# Altium project Relay_board.PrjPcb
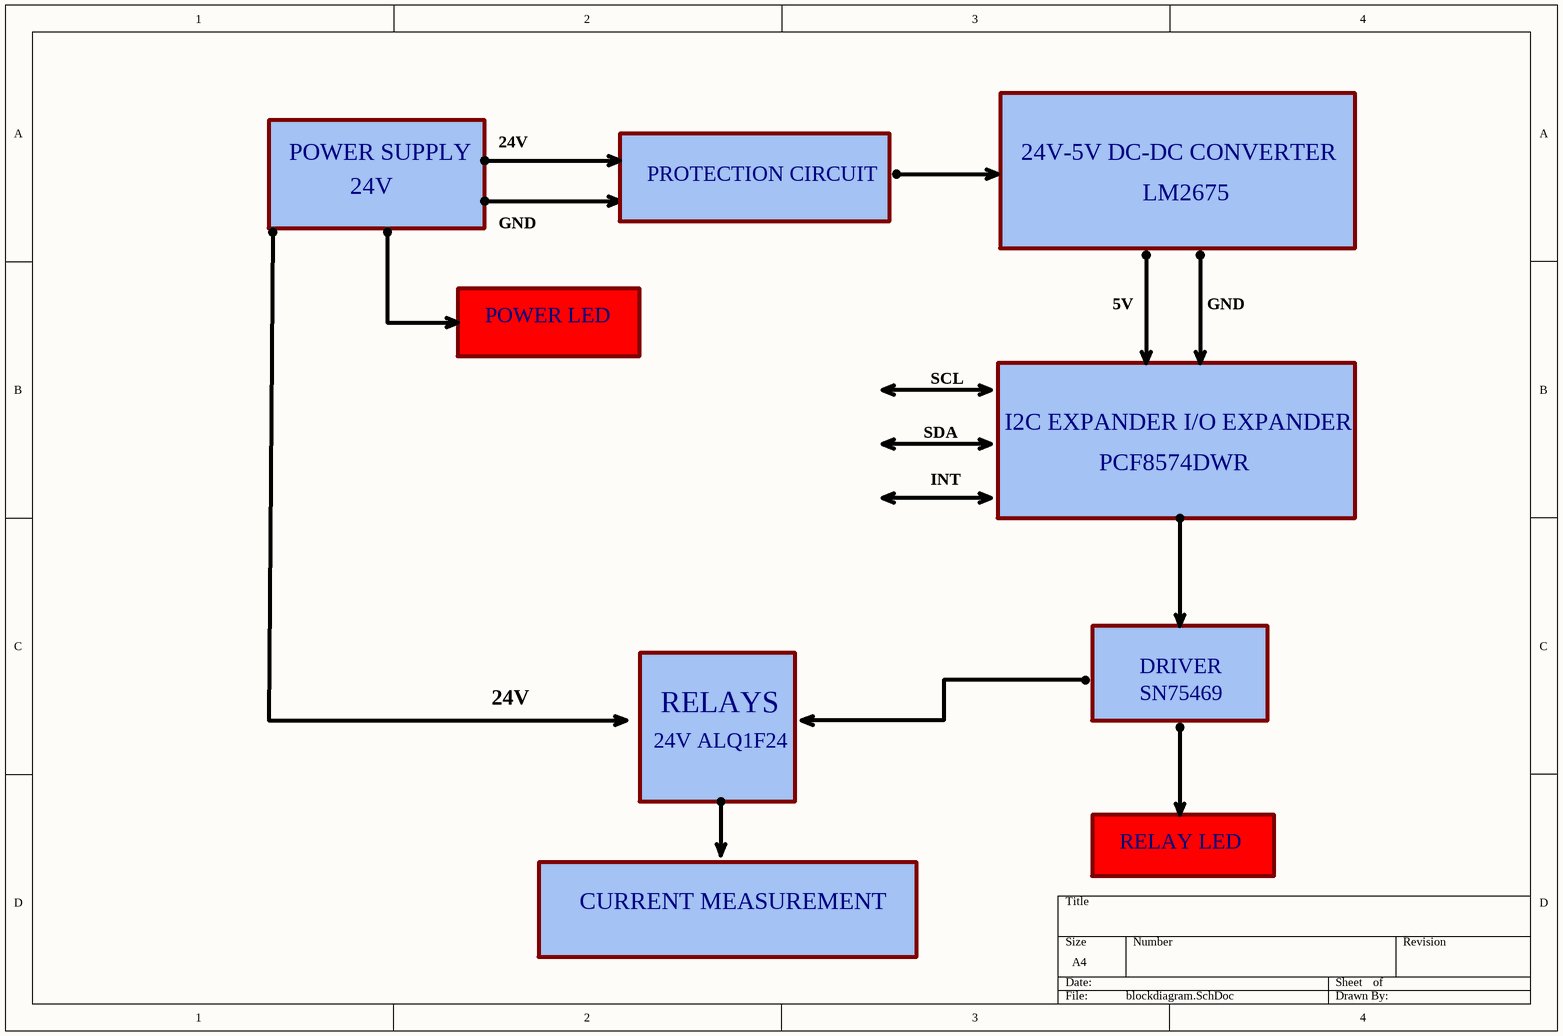
[diagram p0: blockdiagram.SchDoc]
3 sheets, 43 parts. Net scope: flat (ports and power ports of the same name join across sheets).
Board file: Relayboard.PcbDoc
Sheets:
  blockdiagram.SchDoc
  RELAYBOARD.SchDoc
  connectors.SchDoc

## Sheet blockdiagram.SchDoc
size A4

### Notes on the sheet
- POWER SUPPLY
- 24V
- 24V-5V DC-DC CONVERTER
- GND
- PROTECTION CIRCUIT
- LM2675
- 5V
- POWER LED
- SCL
- SDA
- I2C EXPANDER I/O EXPANDER
- INT
- PCF8574DWR
- RELAYS
- DRIVER
- SN75469
- 24V ALQ1F24
- RELAY LED
- CURRENT MEASUREMENT

## Sheet RELAYBOARD.SchDoc
size A4
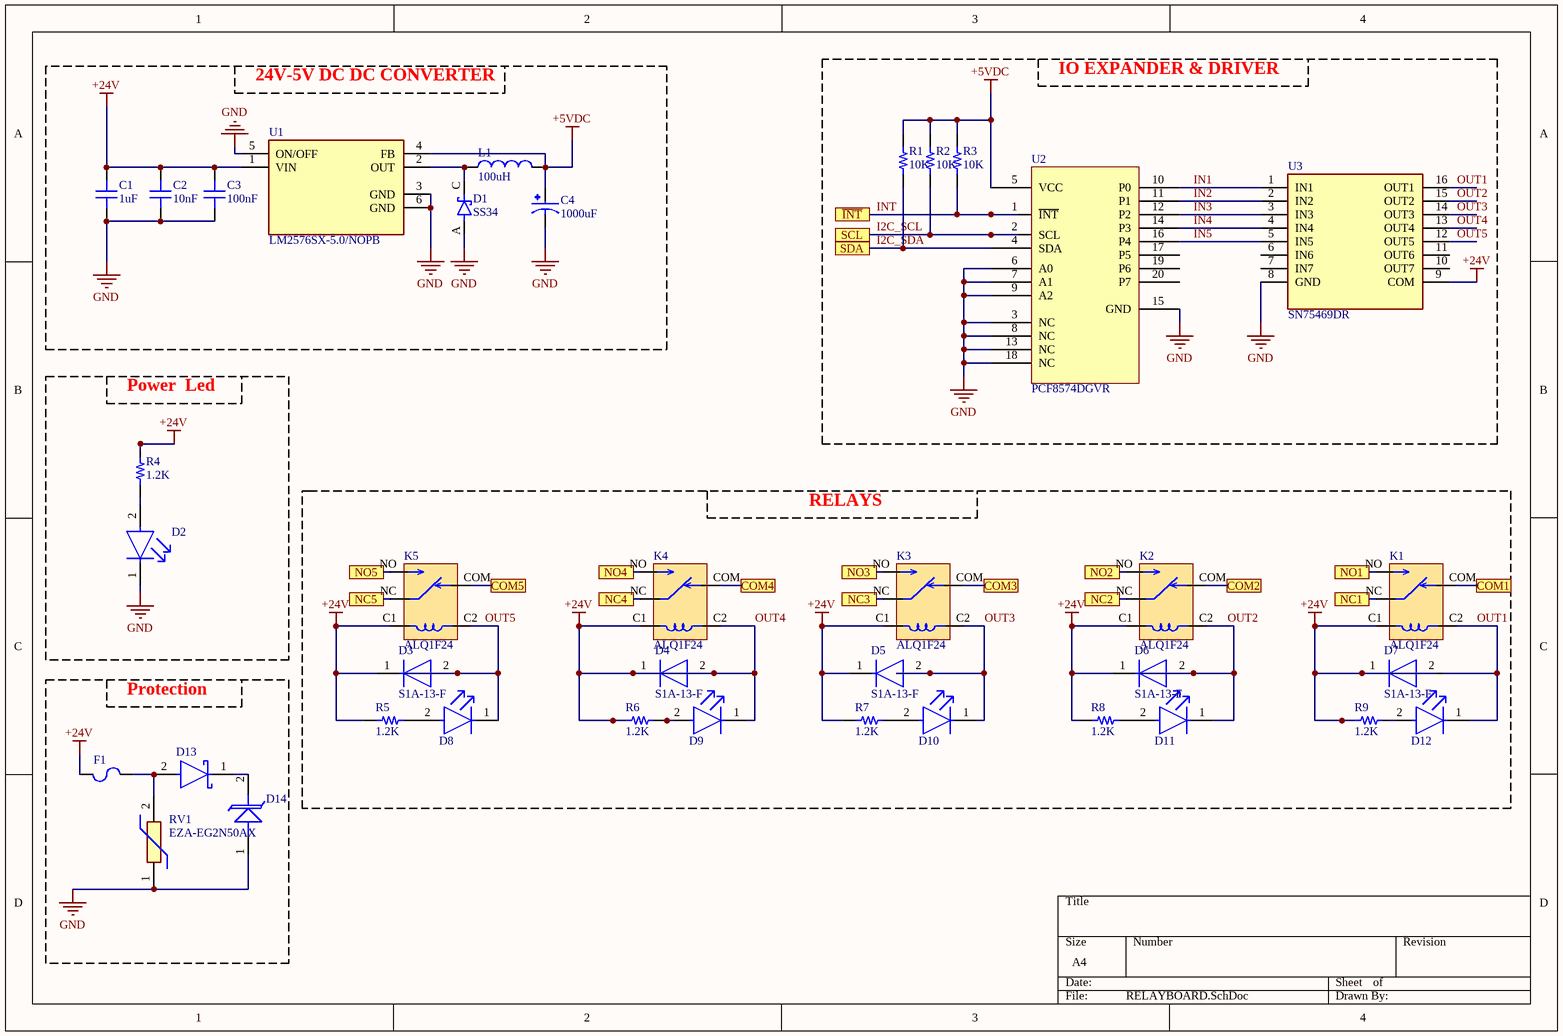
[diagram p1: RELAYBOARD.SchDoc]

### Parts
C1  1uF  [CAP-0603]
C2  10nF  [CAP-0603]
C3  100nF  [CAP-0603]
C4  1000uF  [CAP RADIAL 1000UF]
D1  SS34  [SS34]
D2  LS R976-NR-1  [LS R976-NR-1]  (value not drawn)
D3  S1A-13-F  [S1A-13-F]
D4  S1A-13-F  [S1A-13-F]
D5  S1A-13-F  [S1A-13-F]
D6  S1A-13-F  [S1A-13-F]
D7  S1A-13-F  [S1A-13-F]
D8  LS R976-NR-1  [LS R976-NR-1]  (value not drawn)
D9  LS R976-NR-1  [LS R976-NR-1]  (value not drawn)
D10  LS R976-NR-1  [LS R976-NR-1]  (value not drawn)
D11  LS R976-NR-1  [LS R976-NR-1]  (value not drawn)
D12  LS R976-NR-1  [LS R976-NR-1]  (value not drawn)
D13  SS3P5-M3/84A  [SS3P5-M3/84A]  (value not drawn)
D14  PESD1IVN27-AX  [PESD1IVN27-AX]  (value not drawn)
F1  SF-1206S150-2  [FUSE 1206_3216 0.6MM]  (value not drawn)
K1  ALQ1F24  [ALQ1F24-5]
K2  ALQ1F24  [ALQ1F24-5]
K3  ALQ1F24  [ALQ1F24-5]
K4  ALQ1F24  [ALQ1F24-5]
K5  ALQ1F24  [ALQ1F24-5]
L1  100uH  [CBC3225T101MR]
R1  10K  [0603]
R2  10K  [0603]
R3  10K  [0603]
R4  1.2K  [0603]
R5  1.2K  [0603]
R6  1.2K  [0603]
R7  1.2K  [0603]
R8  1.2K  [0603]
R9  1.2K  [0603]
RV1  EZA-EG2N50AX  [EZA-EG2N50AX]
U1  LM2576SX-5.0/NOPB  [LM2576SX-5.0/NOPB]
U2  PCF8574DGVR  [TVSOP-20]
U3  SN75469DR  [SN75469DR-SOIC16]

### Blocks framed on the sheet
24V-5V DC DC CONVERTER: C1-C4 D1 L1 U1
IO EXPANDER & DRIVER: R1-R3 U2 U3
Power  Led: D2 R4
RELAYS: D3-D12 K1-K5 R5-R9
Protection: D13 D14 F1 RV1

### Ports
COM1, COM2, COM3, COM4, COM5, NC1, NC2, NC3, NC4, NC5, NO1, NO2, NO3, NO4, NO5, SCL, SDA, ~{INT}

### Nets
+5VDC: C4.1 L1.2 R1.2 R2.2 R3.2 U1.4(FB) U2.5(VCC)
GND: C1.1 C2.1 C3.1 C4.2 D1.A D2.1(C) D14.1 RV1.1 U1.3(GND) U1.5(ON/OFF) U1.6(GND) U2.3(NC) U2.6(A0) U2.7(A1) U2.8(NC) U2.9(A2) U2.13(NC) U2.15(GND) U2.18(NC) U3.8(GND)
OUT4: C1.2 C2.2 C3.2 D3.1(C) D4.1(C) D4.2(A) D5.1(C) D6.1(C) D7.1(C) D9.1(C) F1.1 K1.C1(COIL_1) K2.C1(COIL_1) K3.C1(COIL_1) K4.C1(COIL_1) K4.C2(COIL_2) K5.C1(COIL_1) R4.2 R5.1 R6.1 R7.1 R8.1 R9.1 U1.1(VIN) U3.9(COM) U3.13(OUT4)  [also labelled +24V]
I2C_SCL: R2.1 U2.2(SCL) ; port SCL
I2C_SDA: R1.1 U2.4(SDA) ; port SDA
IN1: U2.10(P0) U3.1(IN1)
IN2: U2.11(P1) U3.2(IN2)
IN3: U2.12(P2) U3.3(IN3)
IN4: U2.14(P3) U3.4(IN4)
IN5: U2.16(P4) U3.5(IN5)
INT: R3.1 U2.1(~{INT}) ; port ~{INT}
OUT1: D7.2(A) D12.1(C) K1.C2(COIL_2) U3.16(OUT1)
OUT2: D6.2(A) D11.1(C) K2.C2(COIL_2) U3.15(OUT2)
OUT3: D5.2(A) D10.1(C) K3.C2(COIL_2) U3.14(OUT3)
OUT5: D3.2(A) D8.1(C) K5.C2(COIL_2) U3.12(OUT5)
NetCN3_1: K1.NO ; port NO1
NetCN3_2: K1.COM ; port COM1
NetCN3_3: K1.NC ; port NC1
NetCN3_4: K2.NO ; port NO2
NetCN3_5: K2.COM ; port COM2
NetCN4_1: K2.NC ; port NC2
NetCN4_2: K3.NO ; port NO3
NetCN4_3: K3.COM ; port COM3
NetCN4_4: K3.NC ; port NC3
NetCN4_5: K4.NO ; port NO4
NetCN5_1: K4.COM ; port COM4
NetCN5_2: K4.NC ; port NC4
NetCN5_3: K5.NO ; port NO5
NetCN5_4: K5.COM ; port COM5
NetCN5_5: K5.NC ; port NC5
NetD1_C: D1.C(K) L1.1 U1.2(OUT)
NetD2_2: D2.2(A) R4.1
NetD8_2: D8.2(A) R5.2
NetD9_2: D9.2(A) R6.2
NetD10_2: D10.2(A) R7.2
NetD11_2: D11.2(A) R8.2
NetD12_2: D12.2(A) R9.2
NetD13_1: D13.1(C) D14.2
NetD13_2: D13.2(A) F1.2 RV1.2

Not connected (* = marked no-connect by the designer): U2 17(P5) 19(P6) 20(P7); U3 6(IN6) 7(IN7) 10(OUT7) 11(OUT6)

### Library data of the parts
C1 = UMK107ABJ105MAHT: Cap Ceramic 1uF 50V X5R 20% Pad SMD 0603 85C Low ESR Automotive T/R; Manufacturer: Taiyo Yuden; Supplier 1: Digi-Key; Manufacturer Part Number: UMK107ABJ105MAHT; RoHS: Yes; Category: Ceramic Capacitors; Stock 1: 1950; Pricing 1: 1=0,27000, 10=0,18400, 50=0,11020, 100=0,09310, 500=0,06368, 1000=0,05634 (USD); Mount: Surface Mount; Case/Package: 0603; Case Code (Imperial): 0603; Case Code (Metric): 1608; Min Operating Temperature: -55°C; Max Operating Temperature: 85°C; Packaging: Tape and Reel; Capacitance: 1uF; Tolerance: 20%; Voltage Rating: 50V; Ratings: AEC-Q200; RoHS Compliant: Yes; ComponentLink1URL: https://www.yuden.co.jp/productdata/catalog/mlcc_all_hq_e.pdf?src-supplier=Digi-Key; ComponentLink1Description: https://www.yuden.co.jp/productdata/catalog/mlcc_all_hq_e.pdf?src-supplier=Digi-Key; Supplier Part Number 1: 587-4958-1-ND
C2 = C0603C103M5RAC7411: Cap Ceramic 0.01uF 50V X7R 20% SMD 0603 125°C Paper T/R; Manufacturer: KEMET; Supplier 1: Digi-Key; Manufacturer Part Number: C0603C103M5RAC7411; RoHS: Yes; Category: Ceramic Capacitors; Stock 1: 336197; Pricing 1: 1=0,10000, 10=0,03000, 50=0,01640, 100=0,01350, 500=0,00962, 1000=0,00756, 2500=0,00688, 5000=0,00632 (USD); Mount: Surface Mount; Case/Package: 0603; Case Code (Imperial): 0603; Case Code (Metric): 1608; Contact Plating: Tin,Matte; Dielectric Material: Ceramic; Min Operating Temperature: -55°C; Max Operating Temperature: 125°C; Packaging: Tape and Reel; Package Quantity: 50000; Tolerance: 20%; Voltage Rating: 50V; Voltage Rating (DC): 50V; Capacitance: 10nF; Dielectric: X7R; Termination: SMD/SMT; Series: C0603C; Construction: Flat; Length: 1.6mm; Height: 0.8mm; Lead Pitch: 0.7mm; Depth: 0.8mm; Radiation Hardening: No; RoHS Compliant: Yes; ComponentLink1URL: http://www.mouser.com/ds/2/212/KEM_C1002_X7R_SMD-1102033.pdf?src-supplier=Mouser; ComponentLink1Description: http://www.mouser.com/ds/2/212/KEM_C1002_X7R_SMD-1102033.pdf?src-supplier=Mouser; ComponentLink2URL: http://capacitoredge.kemet.com/capedge2/DataSheet?pn=C0603C103M5RAC7411&src-supplier=Avnet; ComponentLink2Description: http://capacitoredge.kemet.com/capedge2/DataSheet?pn=C0603C103M5RAC7411&src-supplier=Avnet; Supplier Part Number 1: 399-C0603C103M5RAC7411CT-ND
C3 = C0603C104K5RAC7411: Cap Ceramic 0.1uF 50V X7R 10% SMD 0603 125°C Paper T/R 100nF; Manufacturer: KEMET; Dissipation Factor: 2.5%; Supplier 1: Digi-Key; Manufacturer Part Number: C0603C104K5RAC7411; RoHS: Yes; Category: Ceramic Capacitors; Stock 1: 3300000; Pricing 1: 15000=0,01540, 30000=0,01463, 75000=0,01309, 105000=0,01059, 150000=0,01024, 375000=0,00963 (USD); Mount: Surface Mount; Case/Package: 0603; Case Code (Metric): 1608; Case Code (Imperial): 0603; Dielectric Material: Ceramic; Min Operating Temperature: -55°C; Max Operating Temperature: 125°C; Tolerance: 10%; Capacitance: 100nF; Dielectric: X7R; Voltage Rating (DC): 50V; Packaging: Tape and Reel; Package Quantity: 15000; Voltage Rating: 50V; Termination: SMD/SMT; Length: 1.6mm; Width: 0.031inch; Height: 0.8mm; Thickness: 0.035inch; Lead Pitch: 0.7mm; Depth: 0.8mm; Radiation Hardening: No; ComponentLink1URL: https://datasheet.ciiva.com/5424/kem-c1002-x7r-smd-5424426.pdf?src-supplier=Mouser; ComponentLink1Description: https://datasheet.ciiva.com/5424/kem-c1002-x7r-smd-5424426.pdf?src-supplier=Mouser; Supplier Part Number 1: 399-7374-2-ND
C4 = EEETK1E102AM: Cap Aluminum Lytic 1000uF 25V 20% (18 X 16.5mm) SMD 0.075 Ohm 1300mA 2000h 125C Automotive T/R; Manufacturer: Panasonic; Manufacturer Part Number: EEE-TK1E102AM; Ripple Current: 1.3A; Capacitance: 1mF; ESR (Equivalent Series Resistance): 75mR; Life (Hours): 2000Hour; Leakage Current: 300uA; Dissipation Factor: 0.18%; Polarity: Polar; Lead Diameter: 1.2mm; Supplier 1: Digi-Key; RoHS: Yes; Category: Aluminum Electrolytic Capacitors; Stock 1: 337; Pricing 1: 1=3,55000, 10=2,86900, 50=2,50360 (USD); Mount: Surface Mount; Case/Package: Radial; Number of Pins: 16; Min Operating Temperature: -40°C; Max Operating Temperature: 125°C; Tolerance: 20%; Voltage Rating: 25V; Ripple Current (AC): 1.3A; Packaging: Tape and Reel; Package Quantity: 125; Voltage Rating (DC): 25V; Termination: SMD/SMT; Voltage: 25V; Series: TK; Construction: Cylindrical; Diameter: 18mm; Length: 16.5mm; Height: 16.5mm; Lead Pitch: 6.7mm; Height - Seated (Max): 0.65inch; REACH SVHC: No SVHC; Lead Free: Lead Free; RoHS Compliant: Yes; ComponentLink1URL: https://datasheet.ciiva.com/11777/0900766b8102e63d-11777138.pdf?src-supplier=RSComponents; ComponentLink1Description: https://datasheet.ciiva.com/11777/0900766b8102e63d-11777138.pdf?src-supplier=RSComponents; ComponentLink2URL: https://datasheet.ciiva.com/24071/aba0000ce121-470559-24071175.pdf?src-supplier=Mouser; ComponentLink2Description: https://datasheet.ciiva.com/24071/aba0000ce121-470559-24071175.pdf?src-supplier=Mouser; Supplier Part Number 1: PCE4890CT-ND
D1 = SS34: SS Series 500 mV 3 A 40 V Max Reverse Voltage Schottky Rectifier - DO-214AB; Manufacturer: ON Semiconductor / Fairchild; Number of Terminals/Pins: 2; Current Rating: 3A; Voltage Rating (DC): 40V; Element Configuration: Single; Max Forward Surge Current (Ifsm): 100A; Max Reverse Current: 500uA; Forward Voltage: 500mV; Polarity: Standard; Max Power Dissipation: 2.27W; Number of Elements: 1; Supplier 1: Digi-Key; Manufacturer Part Number: SS34; RoHS: Yes; Category: Schottky Diodes; Stock 1: 48500; Pricing 1: 3000=0,28805 (USD); Mount: Surface Mount; Case/Package: SMC; Number of Pins: 2; Contact Plating: Tin,Matte; Min Operating Temperature: -55°C; Max Operating Temperature: 150°C; Packaging: Tape and Reel; Package Quantity: 1; Forward Current: 3A; Max Repetitive Reverse Voltage (Vrrm): 40V; Output Current: 3A; Peak Non-Repetitive Surge Current: 100A; Average Rectified Current: 3A; Max Reverse Voltage (DC): 40V; Max Surge Current: 100A; Max Reverse Leakage Current: 500uA; Current: 3A; Voltage: 40V; Length: 7.15mm; Width: 6.25mm; Height: 2.75mm; Radiation Hardening: No; RoHS Compliant: Yes; REACH SVHC: No SVHC; Lead Free: Lead Free; Supplier Part Number 1: SS34FSTR-ND
D2 D8-D12 = LS R976-NR-1: Led SMT Red 0805 Tape; Manufacturer: Osram Opto; Lens Color: White; Forward Current: 25mA; Forward Voltage: 2.5V; Luminous Intensity: 180mcd; Viewing Angle: 160°; Lens Style: Flat,Diffused,Colorless,Rectangular; Test Current: 20mA; Dominant Wavelength: 633nm; Luminous Flux: 0.47lm; Number of Elements: 1; Reverse Voltage: 12V; Power Dissipation: 65mW; Lens Transparency: Diffused; Lens Size: 1.25mm; Supplier 1: Digi-Key; Manufacturer Part Number: LSR976-NR-1; RoHS: Yes; Category: LEDs; Stock 1: 165904; Pricing 1: 1=0,31000, 10=0,16700, 100=0,07750, 500=0,07152, 1000=0,05602, 2000=0,05483 (USD); Mount: Surface Mount; Case/Package: 0805; Number of Pins: 2; Color: Red; Case Code (Metric): 2012; Case Code (Imperial): 0805; Min Operating Temperature: -30°C; Max Operating Temperature: 85°C; Packaging: Tape and Reel; Number of LEDs: 1; Illumination Color: Red; Package Quantity: 16000; Series: CHIPLED 0805; Length: 2.1mm; Width: 1.25mm; Height: 0.9mm; Depth: 1.35mm; Radiation Hardening: No; RoHS Compliant: Yes; ComponentLink1URL: https://datasheet.ciiva.com/4688/o-ls-ly-r976-24152-4688435.pdf?src-supplier=Mouser; ComponentLink1Description: https://datasheet.ciiva.com/4688/o-ls-ly-r976-24152-4688435.pdf?src-supplier=Mouser; ComponentLink2URL: https://datasheet.ciiva.com/26920/getdatasheetpartid-568367-26920831.pdf?src-supplier=Verical; ComponentLink2Description: https://datasheet.ciiva.com/26920/getdatasheetpartid-568367-26920831.pdf?src-supplier=Verical; ComponentLink3URL: https://datasheet.ciiva.com/2112/00078896-0-2112782.pdf?src-supplier=Digi-Key; ComponentLink3Description: https://datasheet.ciiva.com/2112/00078896-0-2112782.pdf?src-supplier=Digi-Key; ComponentLink4URL: https://datasheet.ciiva.com/2112/00078896-0-2112781.pdf?src-supplier=Digi-Key; ComponentLink4Description: https://datasheet.ciiva.com/2112/00078896-0-2112781.pdf?src-supplier=Digi-Key; ComponentLink5URL: https://datasheet.ciiva.com/2112/00078896-0-2112783.pdf?src-supplier=Digi-Key; ComponentLink5Description: https://datasheet.ciiva.com/2112/00078896-0-2112783.pdf?src-supplier=Digi-Key; Supplier Part Number 1: 475-1278-1-ND
D3-D7 = S1A-13-F: VR=50V IF=1A 10pF Trr=3us; Manufacturer: Diodes; Forward Current: 1A; Max Repetitive Reverse Voltage (Vrrm): 50V; Element Configuration: Single; Reverse Recovery Time: 3us; Peak Non-Repetitive Surge Current: 30A; Max Reverse Current: 5uA; Forward Voltage: 1.1V; Recovery Time: 1.8us; Polarity: Standard; Supplier 1: Digi-Key; Manufacturer Part Number: S1A-13-F; RoHS: Yes; Category: Rectifier Diodes; Stock 1: 971381; Pricing 1: 1=0,27000, 10=0,22300, 100=0,11850, 500=0,07796, 1000=0,05301, 2000=0,04782 (USD); Mount: Surface Mount; Case/Package: SMA; Number of Pins: 2; Weight: 0.002258oz; Min Operating Temperature: -65°C; Max Operating Temperature: 150°C; Packaging: Tape and Reel; Package Quantity: 5000; Max Surge Current: 30A; Reverse Voltage (DC): 50V; Average Rectified Current: 1A; Voltage Rating (DC): 50V; Current Rating: 1A; Capacitance: 10pF; Output Current: 1A; Max Reverse Voltage (DC): 50V; Series: -; Max Forward Surge Current (Ifsm): 30A; Termination: SMD/SMT; Length: 4.6mm; Width: 2.92mm; Height: 2.1mm; Radiation Hardening: No; Lead Free: Lead Free; RoHS Compliant: Yes; REACH SVHC: No SVHC; ComponentLink1URL: https://datasheet.ciiva.com/911/ds16003-911872.pdf?src-supplier=Digi-Key; ComponentLink1Description: https://datasheet.ciiva.com/911/ds16003-911872.pdf?src-supplier=Digi-Key; ComponentLink2URL: https://datasheet.ciiva.com/27052/1541520-27052419.pdf?src-supplier=Jameco; ComponentLink2Description: https://datasheet.ciiva.com/27052/1541520-27052419.pdf?src-supplier=Jameco; ComponentLink3URL: https://datasheet.ciiva.com/8301/ds16003-8301429.pdf?src-supplier=Avnet; ComponentLink3Description: https://datasheet.ciiva.com/8301/ds16003-8301429.pdf?src-supplier=Avnet; ComponentLink4URL: https://datasheet.ciiva.com/22695/1911706-22695830.pdf?src-supplier=Element14; ComponentLink4Description: https://datasheet.ciiva.com/22695/1911706-22695830.pdf?src-supplier=Element14; ComponentLink5URL: https://datasheet.ciiva.com/4453/ds16003-83672-4453580.pdf?src-supplier=Mouser; ComponentLink5Description: https://datasheet.ciiva.com/4453/ds16003-83672-4453580.pdf?src-supplier=Mouser; ComponentLink6URL: https://datasheet.ciiva.com/16199/ds16003-16199336.pdf?src-supplier=Future+Electronics; ComponentLink6Description: https://datasheet.ciiva.com/16199/ds16003-16199336.pdf?src-supplier=Future+Electronics; ComponentLink7URL: https://datasheet.ciiva.com/25953/ds16003-25953033.pdf?src-supplier=Avnet+Europe; ComponentLink7Description: https://datasheet.ciiva.com/25953/ds16003-25953033.pdf?src-supplier=Avnet+Europe; Supplier Part Number 1: S1A-FDICT-ND
D13 = SS3P5-M3/84A: VISHAY   SS3P5-M3/84A   DIODE, RECTIFIER, SCHOTTKY, 3A, 50V, SMP; Max Reverse Current: 100uA; Forward Voltage: 780mV; Max Forward Surge Current (Ifsm): 45A; Element Configuration: Single; Supplier 1: Digi-Key; Manufacturer: Vishay; Manufacturer Part Number: SS3P5-M3/84A; RoHS: Yes; Category: Rectifier Diodes; Stock 1: 773; Pricing 1: 1=0,45000, 10=0,34200, 100=0,21320, 500=0,14586, 1000=0,11220 (USD); Mount: Surface Mount; Case/Package: DO-220AA; Number of Pins: 2; Weight: 0.000847oz; Min Operating Temperature: -55°C; Max Operating Temperature: 150°C; Forward Current: 3A; Packaging: Tape and Reel; Package Quantity: 3000; Average Rectified Current: 3A; Max Repetitive Reverse Voltage (Vrrm): 50V; Peak Non-Repetitive Surge Current: 45A; Max Reverse Voltage (DC): 50V; Series: eSMP®; Length: 3.61mm; Width: 2.18mm; Height: 1.15mm; Radiation Hardening: No; REACH SVHC: Unknown; RoHS Compliant: Yes; ComponentLink1URL: https://datasheet.ciiva.com/25932/ss3p5-25932345.pdf?src-supplier=Avnet+Europe; ComponentLink1Description: https://datasheet.ciiva.com/25932/ss3p5-25932345.pdf?src-supplier=Avnet+Europe; ComponentLink2URL: https://datasheet.ciiva.com/29591/ss3p5-29591977.pdf?src-supplier=Digi-Key; ComponentLink2Description: https://datasheet.ciiva.com/29591/ss3p5-29591977.pdf?src-supplier=Digi-Key; ComponentLink3URL: https://datasheet.ciiva.com/8289/ss3p5-8289162.pdf?src-supplier=Avnet; ComponentLink3Description: https://datasheet.ciiva.com/8289/ss3p5-8289162.pdf?src-supplier=Avnet; ComponentLink4URL: https://datasheet.ciiva.com/7962/ss3p5-7962430.pdf?src-supplier=Element14; ComponentLink4Description: https://datasheet.ciiva.com/7962/ss3p5-7962430.pdf?src-supplier=Element14; Supplier Part Number 1: SS3P5-M3/84AGIDKR-ND
D14 = PESD1IVN27-AX: PESD1IVN27-A/SOD323/SOD2; Manufacturer: Nexperia; Supplier 1: Digi-Key; Manufacturer Part Number: PESD1IVN27-AX; RoHS: Yes; Category: TVS Diodes; Stock 1: 374; Pricing 1: 1=0,38000, 10=0,28000, 100=0,15850, 500=0,10494, 1000=0,08045 (USD); RoHS Compliant: Yes; Supplier Part Number 1: 1727-7621-1-ND
F1 = SF-1206S150-2: FUSE BOARD MOUNT 1.5A 63VDC 1206; Manufacturer: Bourns Inc.; Approval Agency: UL; Breaking Capacity @ Rated Voltage: 50A; Fuse Type: Board Mount (Cartridge Style Excluded); Melting I²t: 0.236; Response Time: Slow Blow; Voltage Rating - DC: 63V; Part Number: SF-1206S150-2; Approvals: UL; ComponentLink1Description: Datasheet; ComponentLink1URL: https://www.bourns.com/docs/Product-Datasheets/sf1206s.pdf; ComponentLink2Description: DigiKey Link; ComponentLink2URL: http://digikey.com/product-detail/en/bourns-inc/SF-1206S150-2/SF-1206S150-2CT-ND/1948213; Current Rating (Amps): 1.5A; Device Package: 1206 (3216 Metric); LastUpdated: 2.09.2020 01:30:42; Lifecycle Status: Active; Minimum Order: 1; Mounting Type: Surface Mount; Operating Temperature: -20°C ~ 105°C; Package / Case: 1206 (3216 Metric); Packaging: TapeAndReel; Part Status: Active; Price: 0.33; Series: SinglFuse™ SF-1206S; Size / Dimension: 0.122" L x 0.061" W x 0.024" H (3.10mm x 1.55mm x 0.60mm); Supplier 1: DigiKey; Supplier Part Number 1: SF-1206S150-2CT-ND
K1-K5 = ALQ1F24: Manufacturer: Panasonic; Supplier 1: Digi-Key; Manufacturer Part Number: ALQ1F24; RoHS: No; Stock 1: 193; Pricing 1: 1=3,01000, 10=2,82200, 25=2,50880, 50=2,38340, 100=2,25790, 250=2,00704, 500=1,88160, 1000=1,75616, 5000=1,69344 (USD); Supplier Part Number 1: 255-ALQ1F24-ND
L1 = CBC3225T101MR: Inductor Power Chip Wirewound 100uH 20% 100KHz Ferrite 0.34A 1.82Ohm DCR 1210 T/R; Manufacturer: Taiyo Yuden; DC Resistance (DCR): 1.82R; Max DC Current: 340mA; Self Resonant Frequency: 6MHz; Shielding: Unshielded; Saturation Current: 270mA; Resistance: 1.4R; Supplier 1: Digi-Key; Manufacturer Part Number: CBC3225T101MR; RoHS: Yes; Category: Fixed Inductors; Stock 1: 46294; Pricing 1: 1=0,30000, 10=0,26800, 25=0,23480, 50=0,20120, 100=0,18450, 250=0,16776, 500=0,15768 (USD); Mount: Surface Mount; Case/Package: 1210; Number of Pins: 2; Core Material: Ferrite; Case Code (Metric): 3225; Case Code (Imperial): 1210; Min Operating Temperature: -40°C; Max Operating Temperature: 105°C; Tolerance: 20%; Inductance: 100uH; Packaging: Tape and Reel; Termination: SMD/SMT; Package Quantity: 1000; Current Rating: 340mA; Test Frequency: 100kHz; Inductance Tolerance: 20%; Resistor Type: Wirewound; DC Current: 340mA; Series: CB; Inductor Type: POWER; Length: 0.126inch; Width: 0.098inch; Height: 2.5mm; Depth: 2.7mm; Height - Seated (Max): 0.106inch; Radiation Hardening: No; Lead Free: Lead Free; RoHS Compliant: Yes; REACH SVHC: Unknown; Military Standard: Not; Halogen Free: Halogen Free; ComponentLink1URL: https://datasheet.ciiva.com/15981/520cbc3225t101mr-15981701.pdf?src-supplier=Onlinecomponents.com; ComponentLink1Description: https://datasheet.ciiva.com/15981/520cbc3225t101mr-15981701.pdf?src-supplier=Onlinecomponents.com; ComponentLink2URL: https://datasheet.ciiva.com/8001/cbc3225t101mr-ss-8001894.pdf?src-supplier=Element14; ComponentLink2Description: https://datasheet.ciiva.com/8001/cbc3225t101mr-ss-8001894.pdf?src-supplier=Element14; ComponentLink3URL: https://datasheet.ciiva.com/26871/getdatasheetpartid-638535-26871174.pdf?src-supplier=Verical; ComponentLink3Description: https://datasheet.ciiva.com/26871/getdatasheetpartid-638535-26871174.pdf?src-supplier=Verical; Supplier Part Number 1: 587-1628-1-ND
R1-R3 = RC0603FR-0710KL: 10 kOhms ±1% 0.1W, 1/10W Chip Resistor 0603 (1608 Metric) Moisture Resistant Thick Film; Manufacturer: Yageo; Resistance: 10kR; Temperature Coefficient: 100ppm/°C; Voltage Rating (DC): 50V; Power Rating: 100mW; Voltage Rating: 75V; Supplier 1: Digi-Key; Manufacturer Part Number: RC0603FR-0710KL; RoHS: Yes; Category: Chip SMD Resistors; Stock 1: 28996893; Pricing 1: 1=0,10000, 10=0,02400, 100=0,00970, 1000=0,00436, 2500=0,00378 (USD); Case/Package: 0603; Number of Pins: 2; Case Code (Imperial): 0603; Case Code (Metric): 1608; Weight: 7.1E-05oz; Size Code: 0603; Min Operating Temperature: -55°C; Max Operating Temperature: 155°C; Tolerance: 1%; Resistor Type: Thick Film; Packaging: Tape and Reel; Termination: SMD/SMT; Features: Moisture Resistant; Series: RC; Max Power Dissipation: 100mW; Number of Terminations: 2; Resistance Tolerance: 1%; Construction: Rectangular; Length: 1.6mm; Width: 0.8mm; Height: 0.45mm; Depth: 0.8mm; Lead Pitch: 0.3mm; REACH SVHC: Unknown; Lead Free: Lead Free; Military Standard: Not; RoHS Compliant: Yes; ComponentLink1URL: https://datasheet.ciiva.com/7660/38590-7660789.pdf?src-supplier=Element14; ComponentLink1Description: https://datasheet.ciiva.com/7660/38590-7660789.pdf?src-supplier=Element14; ComponentLink2URL: https://datasheet.ciiva.com/7983/443971-7983596.pdf?src-supplier=Element14; ComponentLink2Description: https://datasheet.ciiva.com/7983/443971-7983596.pdf?src-supplier=Element14; ComponentLink3URL: https://datasheet.ciiva.com/22747/443971-22747519.pdf?src-supplier=Element14; ComponentLink3Description: https://datasheet.ciiva.com/22747/443971-22747519.pdf?src-supplier=Element14; ComponentLink4URL: https://datasheet.ciiva.com/46440/1868787-46440891.pdf?src-supplier=Element14; ComponentLink4Description: https://datasheet.ciiva.com/46440/1868787-46440891.pdf?src-supplier=Element14; ComponentLink5URL: https://datasheet.ciiva.com/7746/1738695-7746239.pdf?src-supplier=Element14; ComponentLink5Description: https://datasheet.ciiva.com/7746/1738695-7746239.pdf?src-supplier=Element14; ComponentLink6URL: https://datasheet.ciiva.com/15189/getdatasheetpartid-409289-15189591.pdf?src-supplier=Verical; ComponentLink6Description: https://datasheet.ciiva.com/15189/getdatasheetpartid-409289-15189591.pdf?src-supplier=Verical; Supplier Part Number 1: 311-10.0KHRCT-ND
R4-R9 = RC0603JR-071K2L: 1.2 kOhms ±5% 0.1W, 1/10W Chip Resistor 0603 (1608 Metric) Moisture Resistant Thick Film; Manufacturer: Yageo; Manufacturer Part Number: RC0402JR-071K2L; Resistance: 1.2kR; Power Rating: 62.5mW; Voltage Rating: 50V; Temperature Coefficient: 100ppm/°C; Max Power Dissipation: 63mW; RoHS: Yes; Category: Chip SMD Resistors; Stock 1: 52843; Pricing 1: 1=0,10000, 10=0,01300, 100=0,00540, 1000=0,00244, 2500=0,00212, 5000=0,00175 (USD); Case/Package: 0402; Case Code (Imperial): 0402; Case Code (Metric): 1005; Size Code: 0402; Min Operating Temperature: -55°C; Max Operating Temperature: 155°C; Tolerance: 5%; Packaging: Tape and Reel; Termination: SMD/SMT; Resistor Type: Thick Film; Features: Moisture Resistant; Series: RC; Number of Terminations: 2; Resistance Tolerance: 5%; Construction: Rectangular; Length: 1mm; Width: 0.5mm; Height: 0.35mm; Depth: 0.5mm; REACH SVHC: No SVHC; Military Standard: Not; Lead Free: Lead Free; RoHS Compliant: Yes; ComponentLink1URL: https://datasheet.ciiva.com/7983/1018594-7983557.pdf?src-supplier=Element14; ComponentLink1Description: https://datasheet.ciiva.com/7983/1018594-7983557.pdf?src-supplier=Element14; ComponentLink2URL: https://datasheet.ciiva.com/12558/pyu-rc0402-51-rohs-l-6-r-8721-12558349.pdf?src-supplier=Mouser; ComponentLink2Description: https://datasheet.ciiva.com/12558/pyu-rc0402-51-rohs-l-6-r-8721-12558349.pdf?src-supplier=Mouser; ComponentLink3URL: https://datasheet.ciiva.com/7850/1018594-7850165.pdf?src-supplier=Element14; ComponentLink3Description: https://datasheet.ciiva.com/7850/1018594-7850165.pdf?src-supplier=Element14; ComponentLink4URL: https://datasheet.ciiva.com/15189/getdatasheetpartid-325064-15189548.pdf?src-supplier=Verical; ComponentLink4Description: https://datasheet.ciiva.com/15189/getdatasheetpartid-325064-15189548.pdf?src-supplier=Verical; ComponentLink5URL: https://datasheet.ciiva.com/17068/pyu-rc0402-51-rohs-l-6-r-17068326.pdf?src-supplier=Future+Electronics; ComponentLink5Description: https://datasheet.ciiva.com/17068/pyu-rc0402-51-rohs-l-6-r-17068326.pdf?src-supplier=Future+Electronics; Stock 2: 141800; Pricing 2: 1=0,10000, 10=0,02000, 100=0,00800, 1000=0,00360, 2500=0,00312 (USD); Number of Pins: 2; Voltage Rating (DC): 50V; Package Quantity: 1; ComponentLink6URL: https://datasheet.ciiva.com/2452/pyu-r-int-thick-7-2452873.pdf?src-supplier=Digi-Key; ComponentLink6Description: https://datasheet.ciiva.com/2452/pyu-r-int-thick-7-2452873.pdf?src-supplier=Digi-Key; ComponentLink7URL: https://datasheet.ciiva.com/2452/pyu-r-int-thick-7-2452874.pdf?src-supplier=Digi-Key; ComponentLink7Description: https://datasheet.ciiva.com/2452/pyu-r-int-thick-7-2452874.pdf?src-supplier=Digi-Key; ComponentLink8URL: https://datasheet.ciiva.com/2452/pyu-r-int-thick-7-2452872.pdf?src-supplier=Digi-Key; ComponentLink8Description: https://datasheet.ciiva.com/2452/pyu-r-int-thick-7-2452872.pdf?src-supplier=Digi-Key; ComponentLink9URL: https://datasheet.ciiva.com/7746/443971-7746456.pdf?src-supplier=Element14; ComponentLink9Description: https://datasheet.ciiva.com/7746/443971-7746456.pdf?src-supplier=Element14; ComponentLink10URL: https://datasheet.ciiva.com/7746/443971-7746455.pdf?src-supplier=Element14; ComponentLink10Description: https://datasheet.ciiva.com/7746/443971-7746455.pdf?src-supplier=Element14; Supplier 1: Digi-Key; Supplier Part Number 1: 311-1.2KGRCT-ND
RV1 = EZA-EG2N50AX: ESD Suppressor Diode TVS Bi-Dir 30V 2-Pin Case 0402 T/R; Manufacturer: Panasonic; Supplier 1: Digi-Key; Manufacturer Part Number: EZA-EG2N50AX; RoHS: No; Category: Varistors; Stock 1: 57944; Pricing 1: 1=0,59000, 10=0,42800, 25=0,33240, 100=0,25180, 250=0,17816, 500=0,14252, 1000=0,10927, 2500=0,09502, 5000=0,08551 (USD); ComponentLink1URL: https://industrial.panasonic.com/cdbs/www-data/pdf/AWD0000/AWD0000C13.pdf?src-supplier=Digi-Key; ComponentLink1Description: https://industrial.panasonic.com/cdbs/www-data/pdf/AWD0000/AWD0000C13.pdf?src-supplier=Digi-Key; Supplier Part Number 1: P122038CT-ND
U1 = LM2576SX-5.0/NOPB: IC REG BUCK 5V 3A TO263-5; Manufacturer: TI National Semiconductor; Number of Outputs: 1; Min Input Voltage: 4V; Max Input Voltage: 40V; Switching Frequency: 52kHz; Efficiency: 77%; Synchronous Rectifier: No; Quiescent Current: 5mA; Output Type: Fixed; Supplier 1: Digi-Key; Manufacturer Part Number: LM2576SX-5.0/NOPB; RoHS: Yes; Category: Voltage Regulators - Switching; Stock 1: 4832; Pricing 1: 1=4,06000, 10=3,64300, 25=3,44400, 100=2,98470, 250=2,83168 (USD); Mount: Surface Mount; Case/Package: TO-263-6; Number of Pins: 5; Contact Plating: Tin; Min Operating Temperature: -40°C; Max Operating Temperature: 125°C; Output Voltage: 5V; Max Output Current: 3A; Operating Supply Voltage: 40V; Packaging: Tape and Reel; Output Current: 3A; Package Quantity: 500; Series: SIMPLE SWITCHER®; Nominal Output Voltage: 5V; Radiation Hardening: No; REACH SVHC: No SVHC; Lead Free: Contains Lead; RoHS Compliant: Yes; ComponentLink1URL: https://datasheet.ciiva.com/41457/001013741-da-01-en-ic-reg-bu-lm2576sx-5-0-nopb-to-263-5-tid-41457614.pdf?src-supplier=Conrad; ComponentLink1Description: https://datasheet.ciiva.com/41457/001013741-da-01-en-ic-reg-bu-lm2576sx-5-0-nopb-to-263-5-tid-41457614.pdf?src-supplier=Conrad; Supplier Part Number 1: LM2576SX-5.0/NOPBCT-ND
U2 = PCF8574DGVR: 8-bit 2.5- to 5.5-V I2C/SMBus I/O expander with interrupt 20-TVSOP -40 to 85; Manufacturer: Texas Instruments; Number of I/Os: 8; Max Frequency: 100kHz; Max Supply Voltage: 6V; Min Supply Voltage: 2.5V; Interface: I2C; Supplier 1: Mouser; Manufacturer Part Number: PCF8574DGVR; RoHS: Yes; Category: Interface ICs; Stock 1: 2777; Pricing 1: 1=1,95000, 10=1,76000, 50=1,66000, 100=1,41000, 1000=0,95900, 10000=0,95900 (USD); Mount: Surface Mount; Case/Package: TFSOP; Number of Pins: 20; Weight: 0.002123oz; Min Operating Temperature: -40°C; Max Operating Temperature: 85°C; Packaging: Tape and Reel; Package Quantity: 1; Frequency: 100kHz; Number of Outputs: 8; Lead Free: Lead Free; RoHS Compliant: Yes; ComponentLink1URL: https://datasheet.ciiva.com/1780/pcf8574-1780221.pdf?src-supplier=Digi-Key; ComponentLink1Description: https://datasheet.ciiva.com/1780/pcf8574-1780221.pdf?src-supplier=Digi-Key; ComponentLink2URL: https://datasheet.ciiva.com/1780/pcf8574-1780220.pdf?src-supplier=Digi-Key; ComponentLink2Description: https://datasheet.ciiva.com/1780/pcf8574-1780220.pdf?src-supplier=Digi-Key; ComponentLink3URL: https://datasheet.ciiva.com/1780/pcf8574-1780222.pdf?src-supplier=Digi-Key; ComponentLink3Description: https://datasheet.ciiva.com/1780/pcf8574-1780222.pdf?src-supplier=Digi-Key; ComponentLink4URL: https://datasheet.ciiva.com/26238/pcf8574-26238107.pdf?src-supplier=Avnet+Europe; ComponentLink4Description: https://datasheet.ciiva.com/26238/pcf8574-26238107.pdf?src-supplier=Avnet+Europe; Supplier Part Number 1: 595-PCF8574DGVR
U3 = SN75469DR: 100-V, 7-ch darlington array with CMOS or PMOS compatibility 16-SOIC 0 to 70; Manufacturer: Texas Instruments; Collector Emitter Voltage (VCEO): 100V; Polarity: NPN; Max Collector Current: 500mA; Number of Drivers: 7; Collector-emitter Voltage-Max: 1.6V; Collector Emitter Saturation Voltage: 1.1V; Supplier 1: Digi-Key; Manufacturer Part Number: SN75469DR; RoHS: Yes; Category: BJTs; Stock 1: 1975; Pricing 1: 1=0,91000, 10=0,81000, 100=0,63140, 500=0,52162, 1000=0,45325 (USD); Mount: Surface Mount; Case/Package: SOIC; Number of Pins: 16; Weight: 0.004998oz; Min Operating Temperature: 0°C; Max Operating Temperature: 70°C; Package Quantity: 2500; Packaging: Tape and Reel; Series: -; Number of Elements: 7; Collector Emitter Breakdown Voltage: 100V; Max Breakdown Voltage: 100V; Radiation Hardening: No; Lead Free: Lead Free; RoHS Compliant: Yes; ComponentLink1URL: https://datasheet.ciiva.com/29571/sn75468-29571866.pdf?src-supplier=Digi-Key; ComponentLink1Description: https://datasheet.ciiva.com/29571/sn75468-29571866.pdf?src-supplier=Digi-Key; ComponentLink2URL: https://datasheet.ciiva.com/29571/sn75468-29571865.pdf?src-supplier=Digi-Key; ComponentLink2Description: https://datasheet.ciiva.com/29571/sn75468-29571865.pdf?src-supplier=Digi-Key; ComponentLink3URL: https://datasheet.ciiva.com/29571/sn75468-29571867.pdf?src-supplier=Digi-Key; ComponentLink3Description: https://datasheet.ciiva.com/29571/sn75468-29571867.pdf?src-supplier=Digi-Key; ComponentLink4URL: https://datasheet.ciiva.com/14424/sn75468-14424055.pdf?src-supplier=Avnet; ComponentLink4Description: https://datasheet.ciiva.com/14424/sn75468-14424055.pdf?src-supplier=Avnet; Supplier Part Number 1: 296-36726-1-ND

## Sheet connectors.SchDoc
size A4
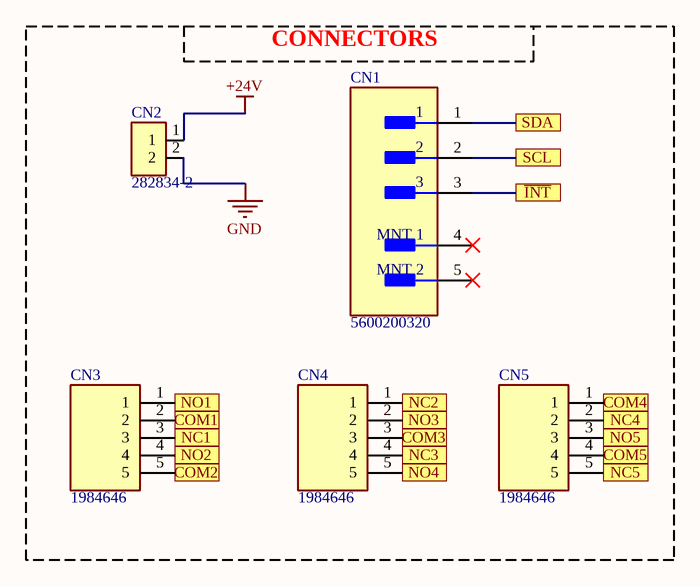
[diagram p2: connectors.SchDoc]

### Parts
CN1  5600200320  [5600200320]
CN2  282834-2  [282834-2]
CN3  1984646  [1984646]
CN4  1984646  [1984646]
CN5  1984646  [1984646]

### Ports
COM1, COM2, COM3, COM4, COM5, NC1, NC2, NC3, NC4, NC5, NO1, NO2, NO3, NO4, NO5, SCL, SDA, ~{INT}

### Nets
+24V: CN2.1  [project net OUT4]
GND: CN2.2
I2C_SCL: CN1.2 ; port SCL
I2C_SDA: CN1.1 ; port SDA
INT: CN1.3 ; port ~{INT}
NetCN3_1: CN3.1 ; port NO1
NetCN3_2: CN3.2 ; port COM1
NetCN3_3: CN3.3 ; port NC1
NetCN3_4: CN3.4 ; port NO2
NetCN3_5: CN3.5 ; port COM2
NetCN4_1: CN4.1 ; port NC2
NetCN4_2: CN4.2 ; port NO3
NetCN4_3: CN4.3 ; port COM3
NetCN4_4: CN4.4 ; port NC3
NetCN4_5: CN4.5 ; port NO4
NetCN5_1: CN5.1 ; port COM4
NetCN5_2: CN5.2 ; port NC4
NetCN5_3: CN5.3 ; port NO5
NetCN5_4: CN5.4 ; port COM5
NetCN5_5: CN5.5 ; port NC5

Not connected (* = marked no-connect by the designer): CN1 4(MNT_1)* 5(MNT_2)*

### Notes on the sheet
- CONNECTORS

### Library data of the parts
CN1 = 5600200320: 2.0mmDuraClik Wire-to-Board Header, Single Row, Vertical, 3 Circuits, Tin (Sn) Over Nickel, Natural; Manufacturer: Molex; Supplier 1: Digi-Key; Manufacturer Part Number: 5600200320; RoHS: Yes; Category: Headers and Wire Housings; Stock 1: 33175; Pricing 1: 1=0,92000, 10=0,75900, 100=0,63250 (USD); ComponentLink1URL: http://www.farnell.com/datasheets/2214714.pdf?src-supplier=Farnell; ComponentLink1Description: http://www.farnell.com/datasheets/2214714.pdf?src-supplier=Farnell; ComponentLink2URL: http://www.literature.molex.com/SQLImages/kelmscott/Molex/PDF_Images/987650-8742.PDF?src-supplier=Digi-Key; ComponentLink2Description: http://www.literature.molex.com/SQLImages/kelmscott/Molex/PDF_Images/987650-8742.PDF?src-supplier=Digi-Key; ComponentLink3URL: http://www.molex.com/pdm_docs/sd/5600200320_sd.pdf?src-supplier=Avnet; ComponentLink3Description: http://www.molex.com/pdm_docs/sd/5600200320_sd.pdf?src-supplier=Avnet; ComponentLink4URL: http://www.farnell.com/datasheets/2214714.pdf?src-supplier=Newark; ComponentLink4Description: http://www.farnell.com/datasheets/2214714.pdf?src-supplier=Newark; Supplier Part Number 1: WM10863CT-ND
CN2 = 282834-2: Conn Terminal Block 2 POS 2.54mm Solder ST Thru-Hole 10A/Contact; Manufacturer: TE Connectivity; Supplier 1: Digi-Key; Manufacturer Part Number: 282834-2; RoHS: Yes; Category: Terminal Blocks; Stock 1: 28181; Pricing 1: 1=1,45000, 10=1,01900, 25=0,95080, 50=0,86300, 100=0,85910, 250=0,72548, 500=0,68728, 1000=0,61092, 5000=0,57274 (USD); ComponentLink1URL: https://datasheet.ciiva.com/11758/0900766b80e7dc96-11758675.pdf?src-supplier=RSComponents; ComponentLink1Description: https://datasheet.ciiva.com/11758/0900766b80e7dc96-11758675.pdf?src-supplier=RSComponents; ComponentLink2URL: https://datasheet.ciiva.com/16386/282834-2-16386363.pdf?src-supplier=Future+Electronics; ComponentLink2Description: https://datasheet.ciiva.com/16386/282834-2-16386363.pdf?src-supplier=Future+Electronics; ComponentLink3URL: https://datasheet.ciiva.com/16676/eng-cs-1308389-eurostyle-terminal-blocks-0607-16676126.pdf?src-supplier=Avnet+Europe; ComponentLink3Description: https://datasheet.ciiva.com/16676/eng-cs-1308389-eurostyle-terminal-blocks-0607-16676126.pdf?src-supplier=Avnet+Europe; ComponentLink4URL: https://datasheet.ciiva.com/823/eng-cd-282834-c1-823453.pdf?src-supplier=Digi-Key; ComponentLink4Description: https://datasheet.ciiva.com/823/eng-cd-282834-c1-823453.pdf?src-supplier=Digi-Key; ComponentLink5URL: https://datasheet.ciiva.com/15169/getdatasheetpartid-155864-15169558.pdf?src-supplier=Verical; ComponentLink5Description: https://datasheet.ciiva.com/15169/getdatasheetpartid-155864-15169558.pdf?src-supplier=Verical; ComponentLink6URL: https://datasheet.ciiva.com/3141/eng-cs-1308389-eurostyle-terminal-blocks-0607-3141115.pdf?src-supplier=Avnet; ComponentLink6Description: https://datasheet.ciiva.com/3141/eng-cs-1308389-eurostyle-terminal-blocks-0607-3141115.pdf?src-supplier=Avnet; ComponentLink7URL: https://datasheet.ciiva.com/30166/eng-cs-1308389-eurostyle-terminal-blocks-0607-30166974.pdf?src-supplier=Onlinecomponents.com; ComponentLink7Description: https://datasheet.ciiva.com/30166/eng-cs-1308389-eurostyle-terminal-blocks-0607-30166974.pdf?src-supplier=Onlinecomponents.com; ComponentLink8URL: https://datasheet.ciiva.com/14609/70086732-14609670.pdf?src-supplier=Allied+Electronics; ComponentLink8Description: https://datasheet.ciiva.com/14609/70086732-14609670.pdf?src-supplier=Allied+Electronics; Supplier Part Number 1: A98333-ND
CN3-CN5 = 1984646: Terminal Block, Printed Circuit, 10 A, 160 V, 3.5 mm, 5, 3.5 mm, 1.2 mm, M2, PA; Manufacturer: Phoenix Contact; Number of Positions: 5; Voltage: 300V; Gender: Male; Current Rating: 17.5A; Voltage Rating: 160V; Number of Levels: 1; Current: 10A; Pitch: 3.5mm; Stripping Length: 5mm; Wire Gauge (Max): 26AWG; Approvals: UL; Supplier 1: Digi-Key; Manufacturer Part Number: 1984646; RoHS: Yes; Category: Terminal Blocks; Stock 1: 1070; Pricing 1: 1=1,25000, 10=1,19900, 50=1,16640, 100=1,09000, 250=1,03768 (USD); Mount: Through Hole; Number of Pins: 5; Contact Material: Tin; Material: Polyamide; Housing Material: Nylon; Color: Green; Weight: 0.080425oz; Housing Color: Green; Insulation Material: Nylon; Packaging: Bulk; Termination: Screw; Number of Contacts: 5; Package Quantity: 100; Number of Positions Per Level: 5; Number of Circuits: 5; Number of Rows: 1; Orientation: Straight; Max Current Rating: 17.5A; Number of Poles: 5; Length: 7.6mm; Width: 17.5mm; Height: 9mm; Depth: 9.2mm; Wire Gauge (Min): 26AWG; Lead Free: Lead Free; Flammability Rating: UL94 V-0; ComponentLink1URL: https://datasheet.ciiva.com/16070/1984646-16070645.pdf?src-supplier=Onlinecomponents.com; ComponentLink1Description: https://datasheet.ciiva.com/16070/1984646-16070645.pdf?src-supplier=Onlinecomponents.com; ComponentLink2URL: https://datasheet.ciiva.com/14608/70055018-14608827.pdf?src-supplier=Allied+Electronics; ComponentLink2Description: https://datasheet.ciiva.com/14608/70055018-14608827.pdf?src-supplier=Allied+Electronics; ComponentLink3URL: https://datasheet.ciiva.com/824/combiconcompactseries-824269.pdf?src-supplier=Digi-Key; ComponentLink3Description: https://datasheet.ciiva.com/824/combiconcompactseries-824269.pdf?src-supplier=Digi-Key; ComponentLink4URL: https://datasheet.ciiva.com/29221/568532-da-01-en-leiterplatten-anschlusskl-1984646-100st-29221147.pdf?src-supplier=Conrad; ComponentLink4Description: https://datasheet.ciiva.com/29221/568532-da-01-en-leiterplatten-anschlusskl-1984646-100st-29221147.pdf?src-supplier=Conrad; Supplier Part Number 1: 277-1723-ND

## Nets that join several sheets
GND: RELAYBOARD (20 pins), connectors (CN2.2)
OUT4: RELAYBOARD (26 pins), connectors (CN2.1)
I2C_SCL: RELAYBOARD (R2.1 U2.2), connectors (CN1.2)
I2C_SDA: RELAYBOARD (R1.1 U2.4), connectors (CN1.1)
INT: RELAYBOARD (R3.1 U2.1), connectors (CN1.3)
NetCN3_1: RELAYBOARD (K1.NO), connectors (CN3.1)
NetCN3_2: RELAYBOARD (K1.COM), connectors (CN3.2)
NetCN3_3: RELAYBOARD (K1.NC), connectors (CN3.3)
NetCN3_4: RELAYBOARD (K2.NO), connectors (CN3.4)
NetCN3_5: RELAYBOARD (K2.COM), connectors (CN3.5)
NetCN4_1: RELAYBOARD (K2.NC), connectors (CN4.1)
NetCN4_2: RELAYBOARD (K3.NO), connectors (CN4.2)
NetCN4_3: RELAYBOARD (K3.COM), connectors (CN4.3)
NetCN4_4: RELAYBOARD (K3.NC), connectors (CN4.4)
NetCN4_5: RELAYBOARD (K4.NO), connectors (CN4.5)
NetCN5_1: RELAYBOARD (K4.COM), connectors (CN5.1)
NetCN5_2: RELAYBOARD (K4.NC), connectors (CN5.2)
NetCN5_3: RELAYBOARD (K5.NO), connectors (CN5.3)
NetCN5_4: RELAYBOARD (K5.COM), connectors (CN5.4)
NetCN5_5: RELAYBOARD (K5.NC), connectors (CN5.5)